# EAGLE design USBasp (EAGLE 6.5.0)
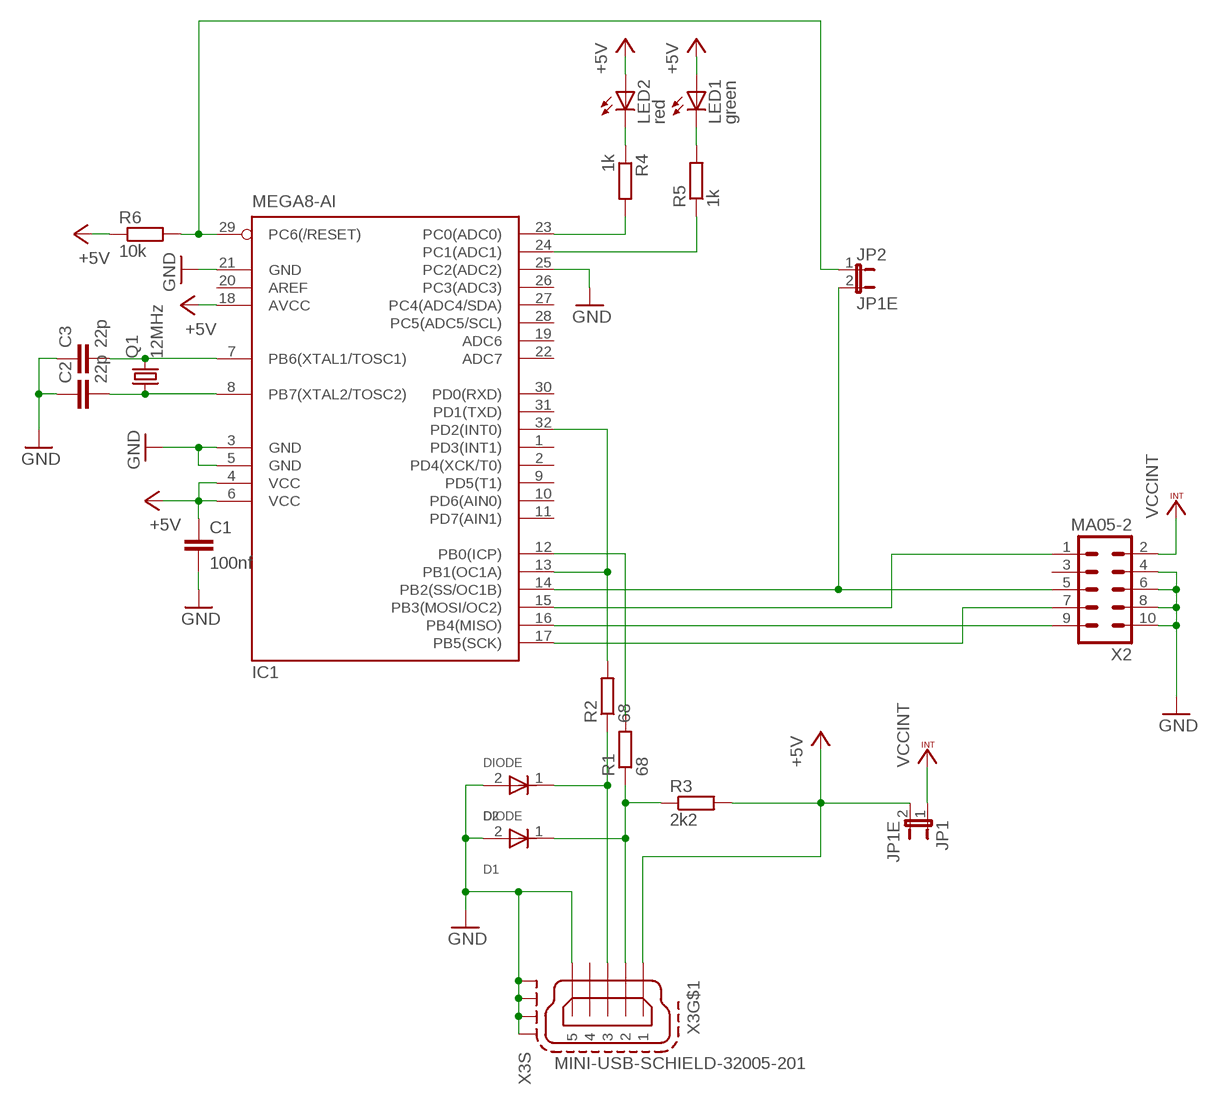
[diagram p0: schematic, sheet 1]

## Parts
C1  100nf  C-EUC0805  [C0805]
C2  22p  C-EUC0805  [C0805]
C3  22p  C-EUC0805  [C0805]
D1  DIODE  [SOD80]
D2  DIODE  [SOD80]
IC1  MEGA8-AI  [TQFP32-08]
JP1  JP1E  [JP0603]
JP2  JP1E  [JP0603]
LED1  green  LEDCHIPLED_0603  [CHIPLED_0603]
LED2  red  LEDCHIPLED_0603  [CHIPLED_0603]
Q1  12MHz  CRYSTALHC49S  [HC49/S]
R1  68  R-EU_R0603  [R0603]
R2  68  R-EU_R0603  [R0603]
R3  2k2  R-EU_R0603  [R0603]
R4  1k  R-EU_R0603  [R0603]
R5  1k  R-EU_R0603  [R0603]
R6  10k  R-EU_R0603  [R0603]
X2  MA05-2  [MA05-2]
X3  MINI-USB-SCHIELD-32005-201  [32005-201]

## Nets
+5V: C1.1 IC1.4(VCC) IC1.6(VCC) IC1.18(AVCC) JP1.2 LED1.A LED2.A R3.2 R6.1 X3.1
GND: C1.2 C2.1 C3.1 D1.2(ANOD) D2.2(ANOD) IC1.3(GND) IC1.5(GND) IC1.21(GND) IC1.25(PC2(ADC2)) X2.4 X2.6 X2.8 X2.10 X3.5 X3.M1(S:S1) X3.M2(S:S2) X3.M3(S:S3) X3.M4(S:S4)
N$1: IC1.23(PC0(ADC0)) R4.2
N$2: LED2.C R4.1
N$3: LED1.C R5.2
N$4: IC1.24(PC1(ADC1)) R5.1
N$6: IC1.29(PC6(/RESET)) JP2.1 R6.2
N$7: C2.2 IC1.8(PB7(XTAL2/TOSC2)) Q1.1
N$8: IC1.14(PB2(SS/OC1B)) JP2.2 X2.5
N$9: IC1.15(PB3(MOSI/OC2)) X2.1
N$10: IC1.17(PB5(SCK)) X2.7
N$11: IC1.16(PB4(MISO)) X2.9
N$12: C3.2 IC1.7(PB6(XTAL1/TOSC1)) Q1.2
N$13: D1.1(KATOD) R1.1 R3.1 X3.2
N$14: D2.1(KATOD) R2.1 X3.3
N$15: IC1.13(PB1(OC1A)) IC1.32(PD2(INT0)) R2.2
N$16: IC1.12(PB0(ICP)) R1.2
VCCINT: JP1.1 X2.2
Unconnected: IC1.1(PD3(INT1)) IC1.2(PD4(XCK/T0)) IC1.9(PD5(T1)) IC1.10(PD6(AIN0)) IC1.11(PD7(AIN1)) IC1.19(ADC6) IC1.20(AREF) IC1.22(ADC7) IC1.26(PC3(ADC3)) IC1.27(PC4(ADC4/SDA)) IC1.28(PC5(ADC5/SCL)) IC1.30(PD0(RXD)) IC1.31(PD1(TXD)) X2.3 X3.4

## Library data of the parts
C1-C3 = rcl:C-EU: CAPACITOR, European symbol
D1 D2 = usb:DIODE: DIODE
IC1 = atmel:MEGA8: MICROCONTROLLER 8 Kbytes FLASH, 1 kbytes SRAM, 512 bytes EEPROM, USART, 6-channel 10 bit ADC, 2-channel 8 bit ADC Pin compatible with Atmega48, ATMega88, ATMega168 Source: avr.lbr; MPN: ATMEGA8-16AU; OC_FARNELL: 9171371; OC_NEWARK: 73M8863
JP1 JP2 = usb:JP1E: JUMPER SMD0603
LED1 LED2 = led:LED: LED OSRAM: - CHIPLED LG R971, LG N971, LY N971, LG Q971, LY Q971, LO R971, LY R971 LH N974, LH R974 LS Q976, LO Q976, LY Q976 LO Q996 - Hyper CHIPLED LW Q18S LB Q993, LB Q99A, LB R99A - SideLED LS A670, LO A670, LY A670, LG A670, LP A670 LB A673, LV A673, LT A673, LW A673 LH A674 LY A675 LS A676, LA A676, LO A676, LY A676, LW A676 LS A679, LY A679, LG A679 - Hyper Micro SIDELED® LS Y876, LA Y876, LO Y876, LY Y876 LT Y87S - SmartLED LW L88C, LW L88S LB L89C, LB L89S, LG L890 LS L89K, LO L89K, LY L89K LS L896, LA L896, LO L896, LY L896 - TOPLED LS T670, LO T670, LY T670, LG T670, LP T670 LSG T670, LSP T670, LSY T670, LOP T670, LYG T670 LG T671, LOG T671, LSG T671 LB T673, LV T673, LT T673, LW T673 LH T674 LS T676, LA T676, LO T676, LY T676, LB T676, LH T676, LSB T676, LW T676 LB T67C, LV T67C, LT T67C, LS T67K, LO T67K, LY T67K, LW E67C LS E67B, LA E67B, LO E67B, LY E67B, LB E67C, LV E67C, LT E67C LW T67C LS T679, LY T679, LG T679 LS T770, LO T770, LY T770, LG T770, LP T770 LB T773, LV T773, LT T773, LW T773 LH T774 LS E675, LA E675, LY E675, LS T675 LS T776, LA T776, LO T776, LY T776, LB T776 LHGB T686 LT T68C, LB T68C - Hyper Mini TOPLED® LB M676 - Mini TOPLED Santana® LG M470 LS M47K, LO M47K, LY M47K Source: http://www.osram.convergy.de LUXEON: - LUMILED® LXK2-PW12-R00, LXK2-PW12-S00, LXK2-PW14-U00, LXK2-PW14-V00 LXK2-PM12-R00, LXK2-PM12-S00, LXK2-PM14-U00 LXK2-PE12-Q00, LXK2-PE12-R00, LXK2-PE12-S00, LXK2-PE14-T00, LXK2-PE14-U00 LXK2-PB12-K00, LXK2-PB12-L00, LXK2-PB12-M00, LXK2-PB14-N00, LXK2-PB14-P00, LXK2-PB14-Q00 LXK2-PR12-L00, LXK2-PR12-M00, LXK2-PR14-Q00, LXK2-PR14-R00 LXK2-PD12-Q00, LXK2-PD12-R00, LXK2-PD12-S00 LXK2-PH12-R00, LXK2-PH12-S00 LXK2-PL12-P00, LXK2-PL12-Q00, LXK2-PL12-R00 Source: www.luxeon.com KINGBRIGHT: KA-3528ASYC Source: www.kingbright.com
Q1 = crystal:CRYSTAL: CRYSTAL; OC_FARNELL: 1667008; OC_NEWARK: unknown
R1-R6 = rcl:R-EU_: RESISTOR, European symbol
X2 = usb:MA05-2: PIN HEADER; OC_FARNELL: unknown; OC_NEWARK: unknown
X3 = con-cypressindustries:MINI-USB-SCHIELD-: MINI USB-B Conector Source: www.cypressindustries.com; OC_FARNELL: unknown; OC_NEWARK: unknown

## Board
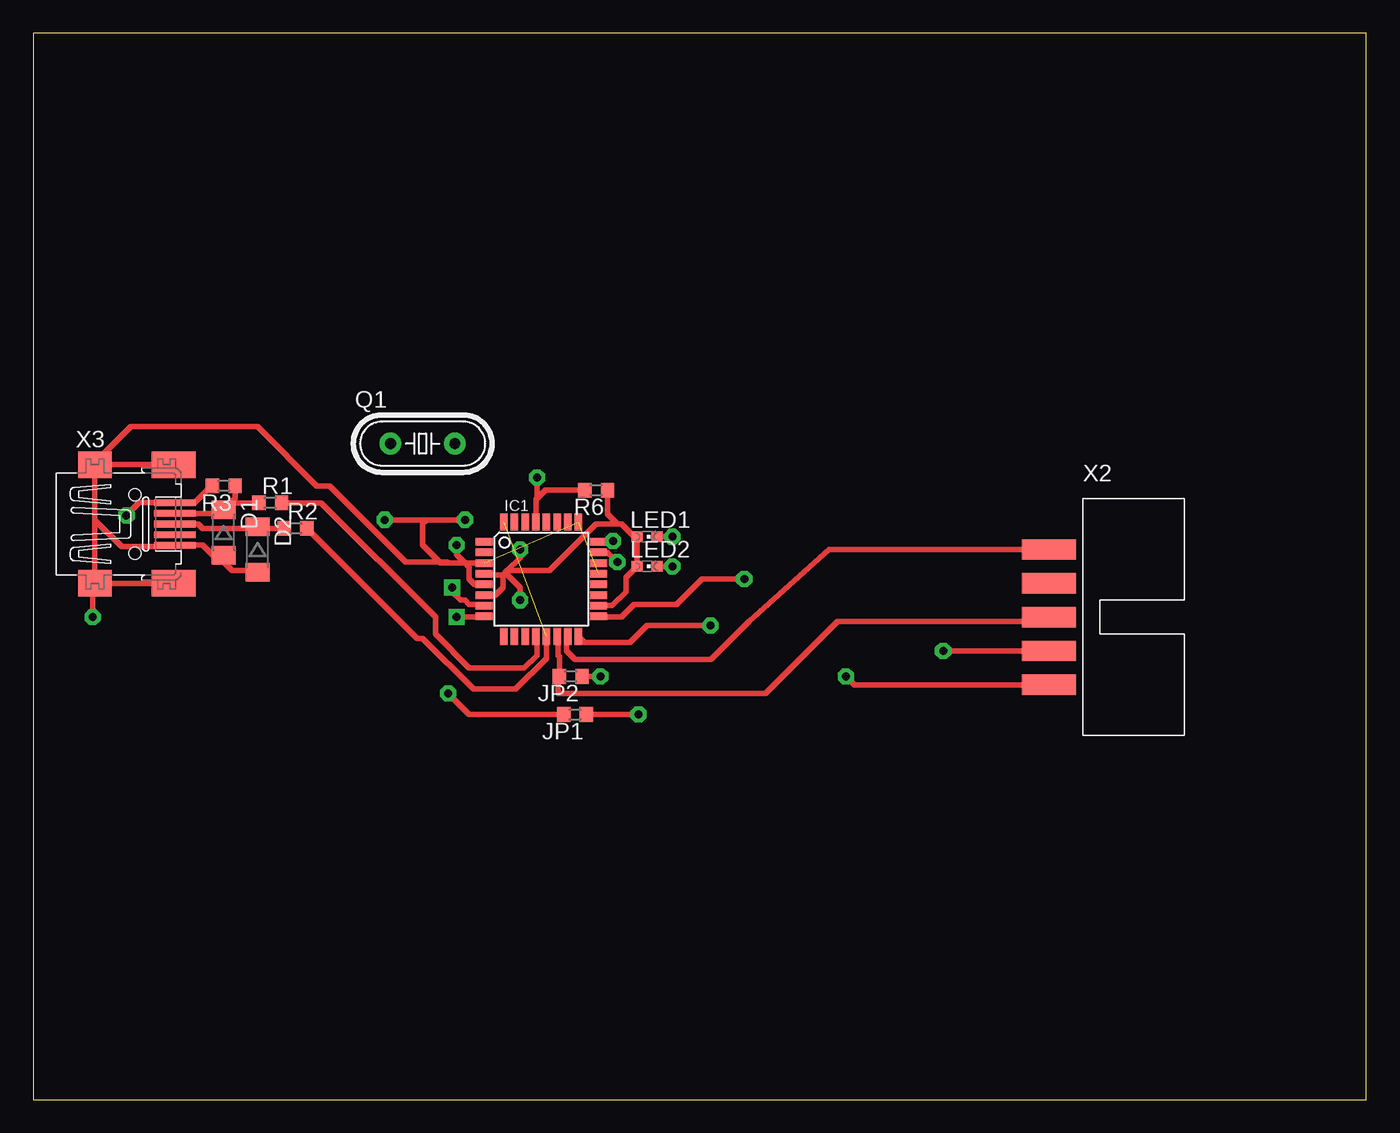
[diagram p1: board, top side]
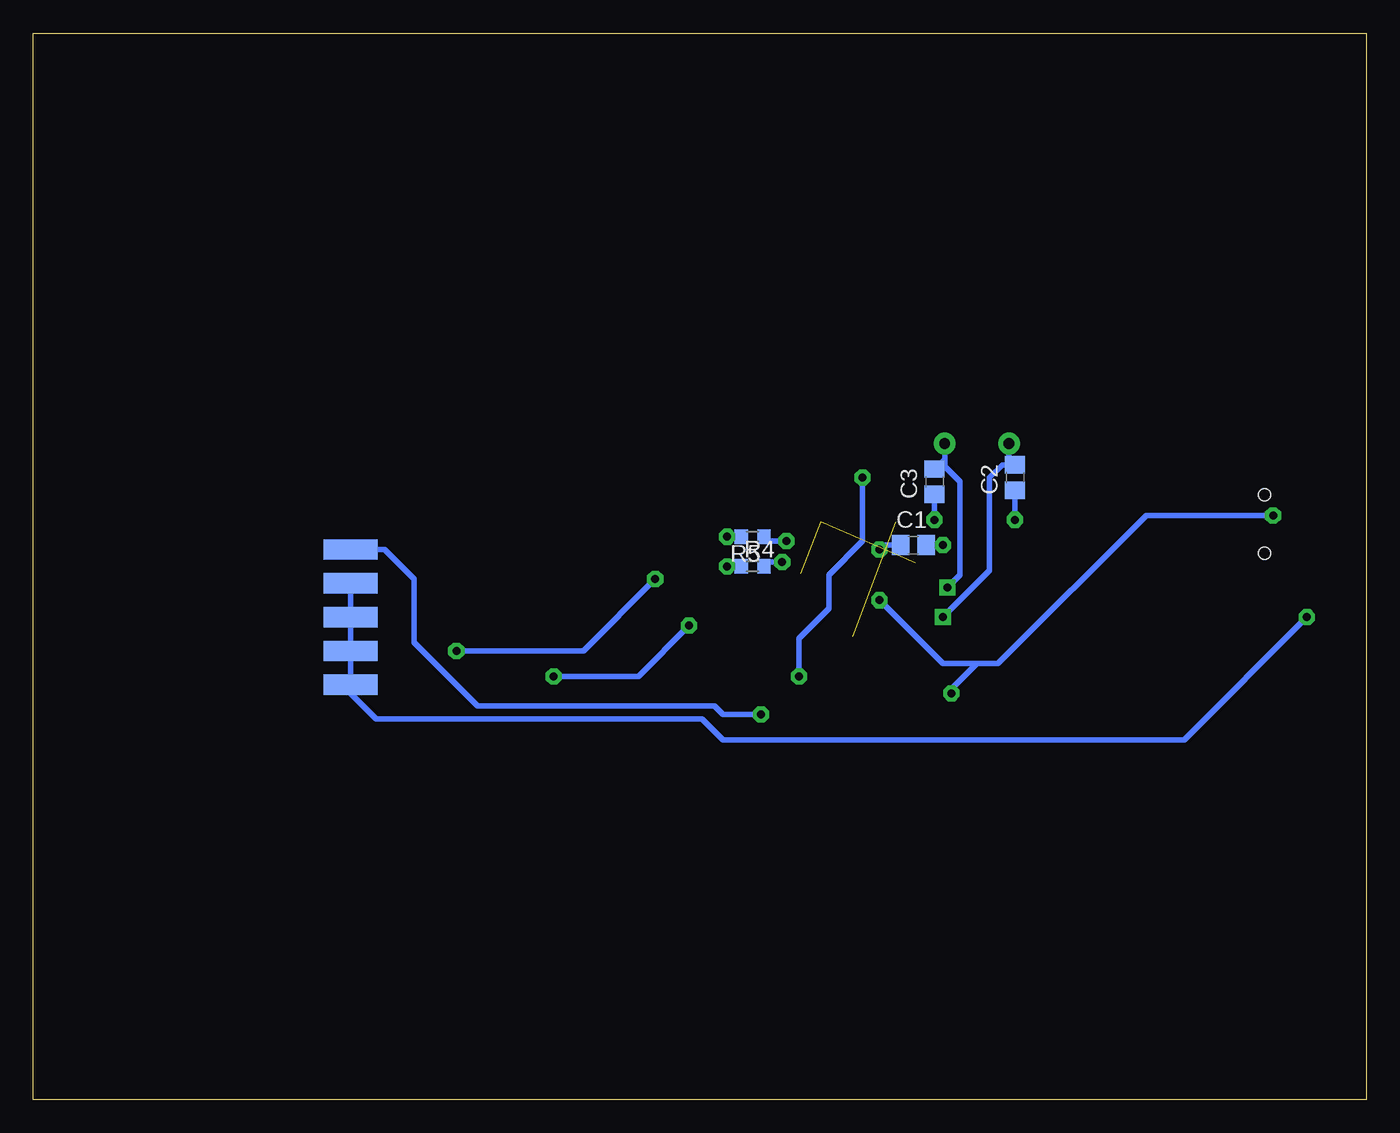
[diagram p2: board, bottom side, seen from below]

Size 100 x 80 mm. Coordinates in mm from the lower left corner, seen from the top.
Outline: 0,0 100,0 100,80 0,80 0,0
Copper layers (1*16): Top 0.035mm / dielectric 1.5mm / Bottom 0.035mm
Design rules "default": minimum track width 12mil, minimum drill 32mil, track to track 12mil, track to pad 12mil, pad to pad 12mil, via to via 12mil, smd to smd 8mil, copper to edge 40mil, drill to drill 8mil, minimum pad ring 16mil, minimum via ring 12mil, stop-mask expansion 4mil, vias tented up to drill 0mil, thermal gap 20mil

### Footprints (pad centres in the part's own frame; a part is rotated, then mirrored left to right if it is on the bottom)
C0805 = smd 1.3 x 1.5: 1 -0.95,0; 2 0.95,0
SOD80 = smd 1.4 x 1.8: 1 -1.7,0; 2 1.7,0
TQFP32-08 = smd 1.27 x 0.559: 1 -4.293,2.8; 2 -4.293,2; 3 -4.293,1.2; 4 -4.293,0.4; 5 -4.293,-0.4; 6 -4.293,-1.2; 7 -4.293,-2; 8 -4.293,-2.8; 17 4.293,-2.8; 18 4.293,-2; 19 4.293,-1.2; 20 4.293,-0.4; 21 4.293,0.4; 22 4.293,1.2; 23 4.293,2; 24 4.293,2.8 | smd 0.559 x 1.27: 9 -2.8,-4.293; 10 -2,-4.293; 11 -1.2,-4.293; 12 -0.4,-4.293; 13 0.4,-4.293; 14 1.2,-4.293; 15 2,-4.293; 16 2.8,-4.293; 25 2.8,4.293; 26 2,4.293; 27 1.2,4.293; 28 0.4,4.293; 29 -0.4,4.293; 30 -1.2,4.293; 31 -2,4.293; 32 -2.8,4.293
JP0603 = smd 1 x 1.1: 1 -0.85,0; 2 0.85,0
CHIPLED_0603 = smd 0.8 x 0.8: A 0,-0.75; C 0,0.75
HC49/S = drill 0.813: 1 -2.413,0; 2 2.413,0
R0603 = smd 1 x 1.1: 1 -0.85,0; 2 0.85,0
MA05-2 = smd 4.064 x 1.524: 1 0,5.08; 3 0,2.54; 5 0,0; 7 0,-2.54; 9 0,-5.08 | smd 4.064 x 1.524 bottom: 2 0,5.08; 4 0,2.54; 6 0,0; 8 0,-2.54; 10 0,-5.08
32005-201 = smd 3.1 x 0.5: 1 3,1.6; 2 3,0.8; 3 3,0; 4 3,-0.8; 5 3,-1.6 | smd 2.5 x 2: M1 -3,-4.45; M2 -3,4.45 | smd 3.3 x 2: M3 2.9,4.45; M4 2.9,-4.45 | hole 0.9: 0,2.2; 0,-2.2

### Placement (x,y rotation side)
C1  33.97,41.59 0 bottom
C2  26.35,46.67 90 bottom
C3  32.38,46.35 90 bottom
D1  14.29,42.55 270 top
D2  16.83,41.27 270 top
IC1  38.1,39.05 0 top
JP1  40.64,28.89 180 top
JP2  40.32,31.75 180 top
LED1  46.04,42.23 270 top
LED2  46.04,40.01 270 top
Q1  29.21,49.21 0 top
R1  17.78,44.77 0 top
R2  19.68,42.86 0 top
R3  14.29,46.04 180 top
R4  46.04,40.01 0 bottom
R5  46.04,42.23 180 bottom
R6  42.23,45.72 180 top
X2  76.2,36.2 0 top
X3  7.62,43.18 0 top

### Tracks (layer width: path | path; a pad name or v marks a point on that pad's centre or on a via)
+5V  (via drill 0.6)
  Top 0.406: R3.2 13.34,46.04 12.06,44.77 10.63,44.77 X3.1 7.95,44.78 v6.99,43.81 | 43.81,43.18 44.13,43.18 45.09,42.23 LED1.A LED2.A 44.45,39.17 44.45,38.1 43.4,37.05 IC1.18 | 43.81,43.18 42.23,43.18 38.73,39.69 35.56,39.69 | 35.56,39.69 35.4,39.53 | 35.4,39.53 35.24,39.37 | 35.24,39.37 33.89,39.37 IC1.4 | IC1.6 34.68,37.85 35.24,38.42 35.24,39.37 | R6.1 43.08,43.92 43.81,43.18 | v36.51,41.27 36.51,40.64 35.56,39.69 | v36.51,37.47 36.51,38.42 35.4,39.53 | JP1.2 32.7,28.89 v31.11,30.48
  Bottom 0.406: C1.1 36.2,41.59 v36.51,41.27 | v6.99,43.81 16.51,43.81 27.62,32.7 29.21,32.7 | 29.21,32.7 31.75,32.7 v36.51,37.47 | v31.11,30.48 31.11,30.8 29.21,32.7
GND  (via drill 0.6)  (2 unrouted)
  Top 0.406: D2.2 16.71,39.69 14.92,39.69 14.29,40.32 D1.2 13.45,40.84 12.7,41.59 10.63,41.59 X3.5 10.52,41.48 6.64,41.48 4.62,43.5 | X3.M2 4.62,43.5 | 4.62,43.5 X3.M1 | X3.M2 X3.M3 | X3.M1 X3.M4 | IC1.3 32.38,40.25 | 32.38,40.25 31.11,40.25 | 31.11,40.25 30.55,40.25 29.21,41.59 29.21,43.18 29.53,43.5 | 29.53,43.5 v26.35,43.5 | v32.38,43.5 29.53,43.5 | IC1.5 33.1,38.65 32.7,39.05 32.7,39.94 32.38,40.25 | v31.75,41.59 31.75,40.89 32.38,40.25 | X3.M2 4.62,47.8 7.3,50.48 16.83,50.48 21.27,46.04 22.23,46.04 27.94,40.32 31.05,40.32 31.11,40.25 | v4.45,36.2 4.45,38.55 X3.M1
  Bottom 0.406: v26.35,43.5 C2.1 | C3.1 v32.38,43.5 | C1.2 v31.75,41.59 | X2.4 X2.6 X2.8 X2.10 76.2,30.48 74.3,28.57 49.85,28.57 48.26,26.99 13.65,26.99 v4.45,36.2
N$1  (via drill 0.6)
  Top 0.406: IC1.23 43.09,41.05 v43.81,40.32
  Bottom 0.406: v43.81,40.32 44.87,40.32 R4.2
N$2  (via drill 0.6)
  Top 0.406: v47.94,40.01 LED2.C
  Bottom 0.406: R4.1 v47.94,40.01
N$3  (via drill 0.6)
  Top 0.406: v47.94,42.23 LED1.C
  Bottom 0.406: R5.2 v47.94,42.23
N$4  (via drill 0.6)
  Top 0.406: IC1.24 43.44,41.85 v43.5,41.91
  Bottom 0.406: v43.5,41.91 44.87,41.91 R5.1
N$6  (via drill 0.6)
  Top 0.406: IC1.29 37.7,45 37.78,45.09 | 37.78,45.09 38.42,45.72 R6.2 | JP2.1 v42.55,31.75 | v37.78,46.67 37.78,45.09
  Bottom 0.406: v42.55,31.75 42.55,34.61 40.32,36.83 40.32,39.37 37.78,41.91 v37.78,46.67
N$7  (via drill 0.6)
  Top 0.406: v31.75,36.2 33.75,36.2 IC1.8
  Bottom 0.406: Q1.1 26.8,48.07 C2.2 27.31,47.62 28.26,46.67 28.26,39.69 v31.75,36.2
N$8
  Top 0.406: IC1.14 39.37,34.69 39.37,33.34 39.47,33.23 JP2.2 39.37,31.65 39.37,30.48 54.93,30.48 60.33,35.88 75.88,35.88 X2.5
N$9
  Top 0.406: X2.1 59.69,41.27 53.69,35.88 | 53.69,35.88 53.34,35.56 | IC1.15 40.01,34.66 40.01,33.66 40.64,33.02 50.84,33.02 53.69,35.88
N$10  (via drill 0.6)
  Top 0.406: X2.7 v68.26,33.66 | v53.34,39.05 50.16,39.05 48.26,37.15 45.09,37.15 44.13,36.2 42.45,36.2 IC1.17
  Bottom 0.406: v68.26,33.66 58.74,33.66 v53.34,39.05
N$11  (via drill 0.6)
  Top 0.406: X2.9 61.59,31.11 v60.96,31.75 | v50.8,35.56 46.04,35.56 44.77,34.29 41.37,34.29 IC1.16
  Bottom 0.406: v60.96,31.75 54.61,31.75 v50.8,35.56
N$12  (via drill 0.6)
  Top 0.406: v31.43,38.42 31.43,38.1 32.07,37.47 32.38,37.47 32.7,37.15 33.71,37.15 IC1.7
  Bottom 0.406: C3.2 31.62,48.07 Q1.2 31.62,47.5 30.48,46.35 30.48,39.37 v31.43,38.42
N$13
  Top 0.406: X3.2 14.02,43.98 D1.1 | R3.1 15.14,45.09 D1.1 | R1.1 14.81,44.77 D1.1
N$14
  Top 0.406: X3.3 12.38,43.18 12.7,42.86 16.71,42.86 D2.1 16.94,42.86 R2.1
N$15  (1 unrouted)
  Top 0.406: IC1.13 38.5,33.1 36.2,30.8 33.02,30.8 29.21,34.61 28.79,34.61 R2.2
N$16
  Top 0.406: R1.2 21.59,44.77 30.16,36.2 30.16,34.92 32.7,32.38 36.83,32.38 37.78,33.34 37.78,34.68 IC1.12
VCCINT  (via drill 0.6)
  Top 0.406: JP1.1 v45.4,28.89
  Bottom 0.406: v45.4,28.89 48.26,28.89 48.9,29.53 66.67,29.53 71.44,34.29 71.44,39.05 73.66,41.27 X2.2